# Altium schematic sheet HEAD.SchDoc
size A4
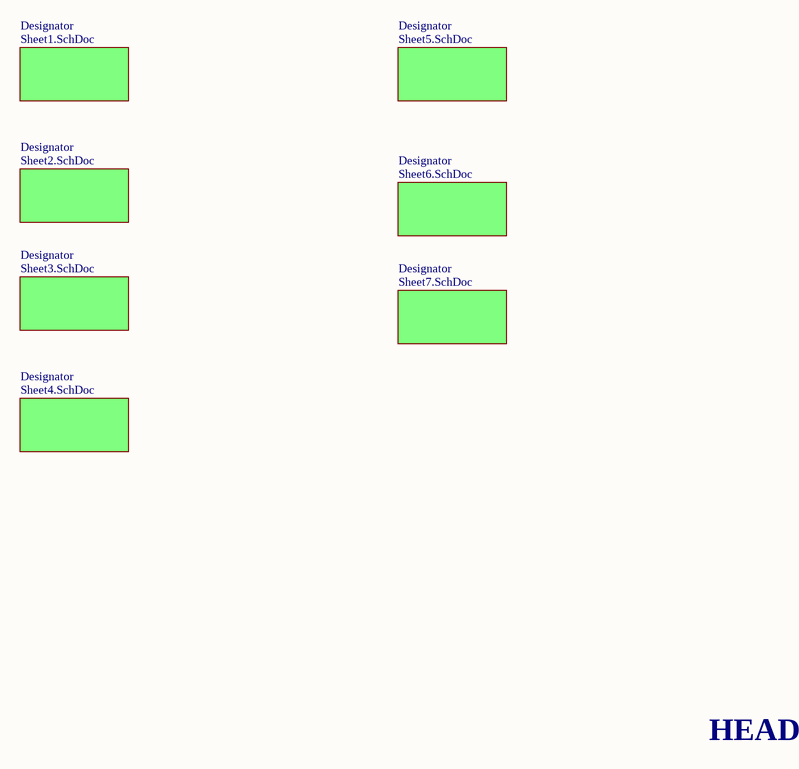
[diagram p0: HEAD.SchDoc]

## Sub-sheets
Designator = Sheet1.SchDoc: no entries
Designator = Sheet2.SchDoc: no entries
Designator = Sheet3.SchDoc: no entries
Designator = Sheet4.SchDoc: no entries
Designator = Sheet5.SchDoc: no entries
Designator = Sheet6.SchDoc: no entries
Designator = Sheet7.SchDoc: no entries

## Notes on the sheet
- HEAD